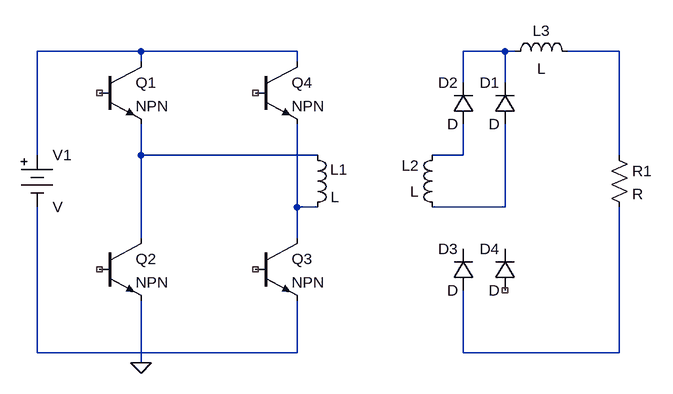
[diagram p0: schematic DC1.asc]
DC1.asc, the LTspice schematic file:
Version 4
SHEET 1 1040 680
WIRE 128 160 -32 160
WIRE 368 160 128 160
WIRE 688 160 624 160
WIRE 704 160 688 160
WIRE 864 160 784 160
WIRE 128 176 128 160
WIRE 368 176 368 160
WIRE 624 208 624 160
WIRE 688 208 688 160
WIRE -32 320 -32 160
WIRE 128 320 128 272
WIRE 400 320 128 320
WIRE 624 320 624 272
WIRE 624 320 576 320
WIRE 864 320 864 160
WIRE 368 400 368 272
WIRE 400 400 368 400
WIRE 688 400 688 272
WIRE 688 400 576 400
WIRE 128 448 128 320
WIRE 368 448 368 400
WIRE 624 480 624 464
WIRE 688 480 688 464
WIRE -32 624 -32 400
WIRE 368 624 368 544
WIRE 368 624 -32 624
WIRE 624 624 624 528
WIRE 864 624 864 400
WIRE 864 624 624 624
WIRE 128 640 128 544
FLAG 128 640 0
SYMBOL diode 704 272 R180
WINDOW 0 24 64 Left 2
WINDOW 3 24 0 Left 2
SYMATTR InstName D1
SYMBOL diode 640 272 R180
WINDOW 0 24 64 Left 2
WINDOW 3 24 0 Left 2
SYMATTR InstName D2
SYMBOL diode 640 528 R180
WINDOW 0 24 64 Left 2
WINDOW 3 24 0 Left 2
SYMATTR InstName D3
SYMBOL diode 704 528 R180
WINDOW 0 24 64 Left 2
WINDOW 3 24 0 Left 2
SYMATTR InstName D4
SYMBOL ind 384 304 R0
WINDOW 0 35 38 Left 2
SYMATTR InstName L1
SYMBOL ind 592 416 R180
WINDOW 0 36 80 Left 2
WINDOW 3 36 40 Left 2
SYMATTR InstName L2
SYMBOL npn 64 176 R0
SYMATTR InstName Q1
SYMBOL npn 64 448 R0
SYMATTR InstName Q2
SYMBOL npn 304 448 R0
SYMATTR InstName Q3
SYMBOL npn 304 176 R0
SYMATTR InstName Q4
SYMBOL ind 688 176 R270
WINDOW 0 32 56 VTop 2
WINDOW 3 5 56 VBottom 2
SYMATTR InstName L3
SYMBOL res 848 304 R0
SYMATTR InstName R1
SYMBOL Misc/battery -32 304 R0
SYMATTR InstName V1

The netlist it stands for:
* DC1.asc
D1 N007 N002 D
D2 N005 N002 D
D3 N011 N008 D
D4 NC_01 N009 D
L1 N004 N006 L
L2 N007 N005 L
Q1 N001 NC_02 N004 0 NPN
Q2 N004 NC_03 0 0 NPN
Q3 N006 NC_04 N010 0 NPN
Q4 N001 NC_05 N006 0 NPN
L3 N002 N003 L
R1 N003 N011 R
V1 N001 N010 V
.model D D
.lib standard.dio
.model NPN NPN
.model PNP PNP
.lib standard.bjt
.backanno
.end